# Altium schematic sheet OpenMPPT2-CAN.SchDoc: =Project + Document
size A4; SheetNumber: 4; SheetTotal: SheetTotaal; Document: CAN
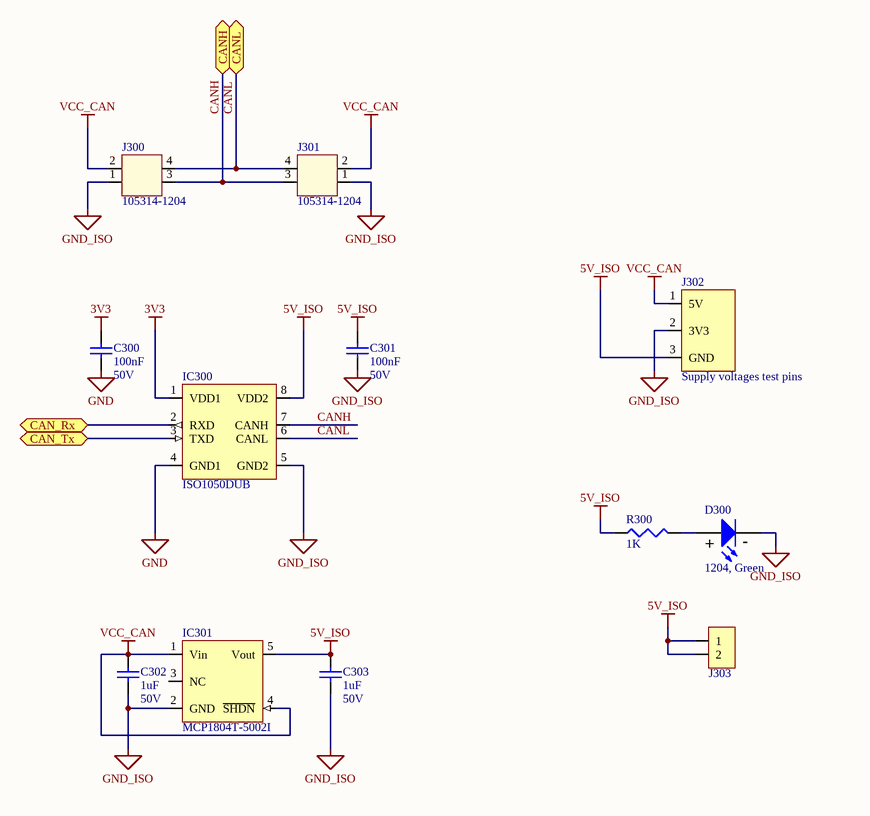
[diagram p0: OpenMPPT2-CAN.SchDoc]

## Parts
C300  100nF  Voltage Rating: 50V  [C0603]
C301  100nF  Voltage Rating: 50V  [C0603]
C302  1uF  Voltage Rating: 50V  [C-0805]
C303  1uF  Voltage Rating: 50V  [C-0805]
D300  1204, Green  [WL-SMSW, 1204]
IC300  ISO1050DUB  [DUB (P-DSO-G8)]
IC301  MCP1804T-5002I  [SOT-23-5]
J300  105314-1204  [Nano-Fit 4p RA]
J301  105314-1204  [Nano-Fit 4p RA]
J302  Supply voltages test pins  [Header 2.54 3p]
J303  2p male right angle header  [2P Angled Header Male, THT]  (value not drawn)
R300  1K  [0603]

## Ports
CAN_Rx, CAN_Tx, CANH, CANL

## Nets
3V3: C300.2 IC300.1(VDD1)
5V_ISO: C301.2 C303.1 IC300.8(VDD2) IC301.5(Vout) J302.3(GND) J303.1 J303.2 R300.1
GND: C300.1 IC300.4(GND1)
GND_ISO: C301.1 C302.2 C303.2 D300.1 IC300.5(GND2) IC301.2(GND) J300.1 J301.1 J302.2(3V3)
VCC_CAN: C302.1 IC301.1(Vin) IC301.4(~{SHDN}) J300.2 J301.2 J302.1(5V)
CAN_Rx: IC300.2(RXD) ; port CAN_Rx
CAN_Tx: IC300.3(TXD) ; port CAN_Tx
CANH: IC300.7(CANH) J300.3 J301.3 ; port CANH
CANL: IC300.6(CANL) J300.4 J301.4 ; port CANL
NetD300_2: D300.2 R300.2

Not connected (* = marked no-connect by the designer): IC301 3(NC)

## Notes on the sheet
- Title
- Size:
- Date:
- A4
- Designer:
- Time:
- Revision:
- Sheet
- of
- File:
- (in symbol 155124GS73200) +; -

## Library data of the parts
C300 C301 = 100nF/0603/CER/50V: Capacitor, 100nF, 50V, X7R; Capacitance Tolerance: ± 10%; Capacitor Case Style: 0603; Brand Number: MCCA000255; Brand: MULTICOMP; Dielectric Characteristic: X7R; Capacitance: 100nF; Temperature Range: -55°C to +125°C; Price: 0,008; Order Code Supplier: 1759122RL; Supplier: Farnell
C302 C303 = 1uF/0805/CER/50V: Capacitor, 1uF, 50V,  X7R; Capacitance Tolerance: ± 10%; Capacitor Case Style: 0805; Brand Number: GRM21BR71H105KA12L; Brand: MURATA; Dielectric Characteristic: X7R; Capacitance: 1uF; Temperature Range: -55°C to +125°C; Price: 0,27; Order Code Supplier: 1735541; Supplier: Farnell
D300 = 155124GS73200: WL-SMSW SMD chip LED side view mono-color waterclear, size 1204, Green; PublishedDate: Oct. 2016; Publisher: Wurth Elektronik; ComponentLink1Description: Manufacturer; ComponentLink1URL: http://www.we-online.de; ComponentLink2Description: Datasheet; ComponentLink2URL: http://katalog.we-online.de/led/datasheet/155124GS73200.pdf; PartNumber: 155124GS73200; Size: 1204; Emitting Color: Green
IC300 = ISO1050DUB: CAN TRANSCEIVER; Brand: Texas Instruments; Case Style: SOIC8; Brand Number: ISO1050DUB; Order Code Supplier: 1755712; Price: 3,81; Supplier: Farnell; Temperature Range: -55°C to +155°C
IC301 = MCP1804T-5002I: LDO, Fixed, 5V, 150mA; Brand: Microchip; Brand Number: MCP1804T-5002I; Case Style: SOT-23-5; Order Code Supplier: 1825007; Price: 0,677; Supplier: Farnell; Temperature Range: -40°C to +85°C
J300 J301 = 105314-1204: Molex nano-fit 4 pins connector, dual row, right angle; Case Style: 105313; Pitch: 2.5mm; Brand: MOLEX; Brand Number: 105314-1204; Order Code Supplier: 538-105314-1204; Price: 1,16; Supplier: Mouser
J302 = Supply voltages test pins: Standard 2.54mm pins for 5V, 3V3, and GND
J303 = 2p male right angle header: 2p 2.54mm male right angle header; Brand: Samtec; Brand Number: TSW-107-08-G-D-RA; Pitch: 2,54mm; Order Code Supplier: 2032722; Price: 1,48; Supplier: Farnell
R300 = 1K/0603/0063W/50V: Resistor, 1K, 1%, 0.063W, 50V, 100PPM, 0603; Brand: MULTICOMP; Brand Number: MC0063W060311K; Case Style: 0603; Order Code Supplier: 2130855; Power Rating: 0.063W; Price: 0,039; Resistance: 1K; Supplier: Farnell; Temperature Coefficient: ± 100PPM; Temperature Range: -55°C to +125°C; Voltage Rating: 50V